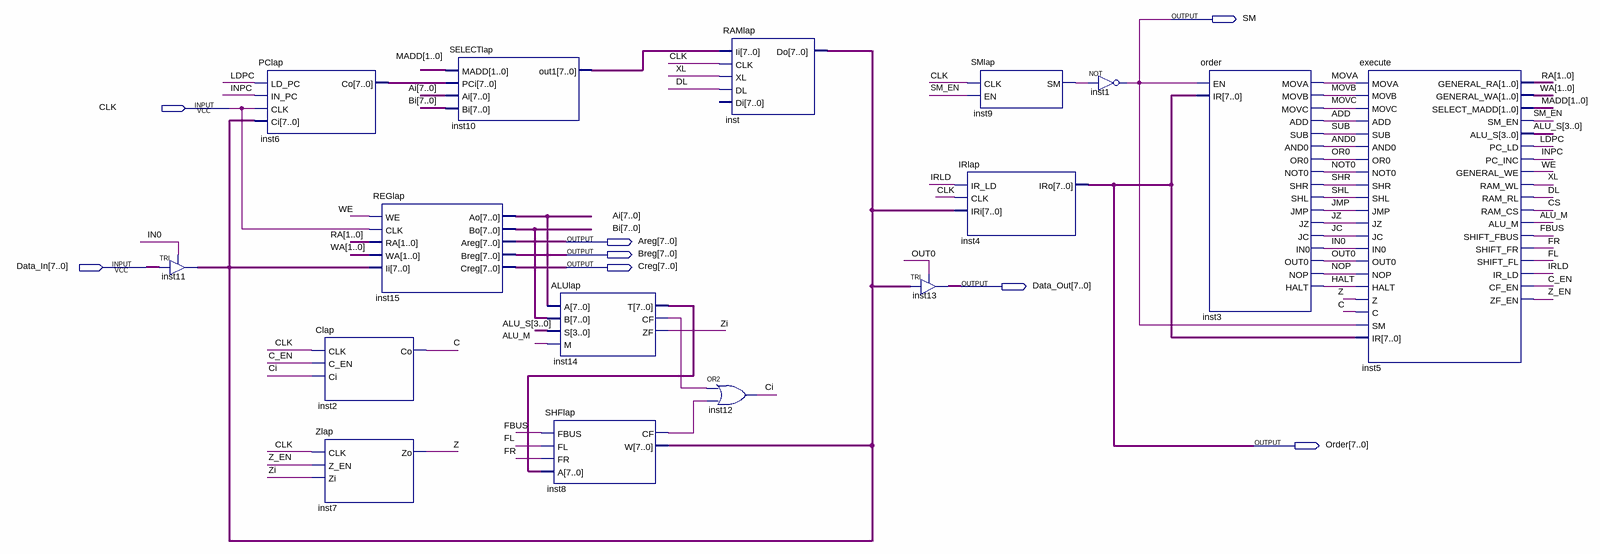
[diagram p0: schematic sheet]
// Quartus schematic CPUlap.bdf as structural Verilog: 16 symbols, 8 pins
module CPUlap (
  input  CLK,
  input  [7:0] Data_In,
  output SM,
  output [7:0] Areg,
  output [7:0] Breg,
  output [7:0] Creg,
  output [7:0] Data_Out,
  output [7:0] Order
);

  wire ADD, ALU_M, AND0, C, C_EN, Ci, CS, DL, FBUS, FL, FR, HALT, IN0, INPC, inst8_cf, inst9_sm, inst14_cf,
       IRLD, JC, JMP, JZ, LDPC, MOVA, MOVB, MOVC, NOP, NOT0, OR0, OUT0, SHL, SHR, SM_EN, SUB, WE, XL, Z,
       Z_EN, Zi;
  wire [1:0] MADD, RA, WA;
  wire [3:0] ALU_S;
  wire [7:0] Ai, Bi, inst6_co, inst10_out1, inst11_out, inst14_t;

  TRI inst11[7:0] (.IN(Data_In), .OE(IN0), .OUT(inst11_out));
  PClap inst6 (.LD_PC(LDPC), .IN_PC(INPC), .CLK(CLK), .Ci(inst11_out), .Co(inst6_co));
  Clap inst2 (.CLK(CLK), .C_EN(C_EN), .Ci(Ci), .Co(C));
  Zlap inst7 (.CLK(CLK), .Z_EN(Z_EN), .Zi(Zi), .Zo(Z));
  REGlap inst15 (
    .WE(WE), .CLK(CLK), .RA(RA), .WA(WA), .Ii(inst11_out), .Ao(Ai), .Bo(Bi), .Areg(Areg), .Breg(Breg),
    .Creg(Creg));
  SELECTlap inst10 (.MADD(MADD), .PCi(inst6_co), .Ai(Ai), .Bi(Bi), .out1(inst10_out1));
  ALUlap inst14 (.A(Ai), .B(Bi), .S(ALU_S), .M(ALU_M), .T(inst14_t), .CF(inst14_cf), .ZF(Zi));
  SHFlap inst8 (.FBUS(FBUS), .FL(FL), .FR(FR), .A(inst14_t), .CF(inst8_cf), .W(inst11_out));
  RAMlap inst (.Ii(inst10_out1), .CLK(CLK), .XL(XL), .DL(DL), .Do(inst11_out));  // open: Di
  or inst12 (Ci, inst14_cf, inst8_cf);
  TRI inst13[7:0] (.IN(inst11_out), .OE(OUT0), .OUT(Data_Out));
  SMlap inst9 (.CLK(CLK), .EN(SM_EN), .SM(inst9_sm));
  IRlap inst4 (.IR_LD(IRLD), .CLK(CLK), .IRi(inst11_out), .IRo(Order));
  not inst1 (SM, inst9_sm);
  order inst3 (
    .EN(SM), .IR(Order), .MOVA(MOVA), .MOVB(MOVB), .MOVC(MOVC), .ADD(ADD), .SUB(SUB), .AND0(AND0), .OR0(OR0),
    .NOT0(NOT0), .SHR(SHR), .SHL(SHL), .JMP(JMP), .JZ(JZ), .JC(JC), .IN0(IN0), .OUT0(OUT0), .NOP(NOP),
    .HALT(HALT));
  execute inst5 (
    .MOVA(MOVA), .MOVB(MOVB), .MOVC(MOVC), .ADD(ADD), .SUB(SUB), .AND0(AND0), .OR0(OR0), .NOT0(NOT0),
    .SHR(SHR), .SHL(SHL), .JMP(JMP), .JZ(JZ), .JC(JC), .IN0(IN0), .OUT0(OUT0), .NOP(NOP), .HALT(HALT), .Z(Z),
    .C(C), .SM(SM), .IR(Order), .GENERAL_RA(RA), .GENERAL_WA(WA), .SELECT_MADD(MADD), .SM_EN(SM_EN),
    .ALU_S(ALU_S), .PC_LD(LDPC), .PC_INC(INPC), .GENERAL_WE(WE), .RAM_WL(XL), .RAM_RL(DL), .RAM_CS(CS),
    .ALU_M(ALU_M), .SHIFT_FBUS(FBUS), .SHIFT_FR(FR), .SHIFT_FL(FL), .IR_LD(IRLD), .CF_EN(C_EN), .ZF_EN(Z_EN));
endmodule
